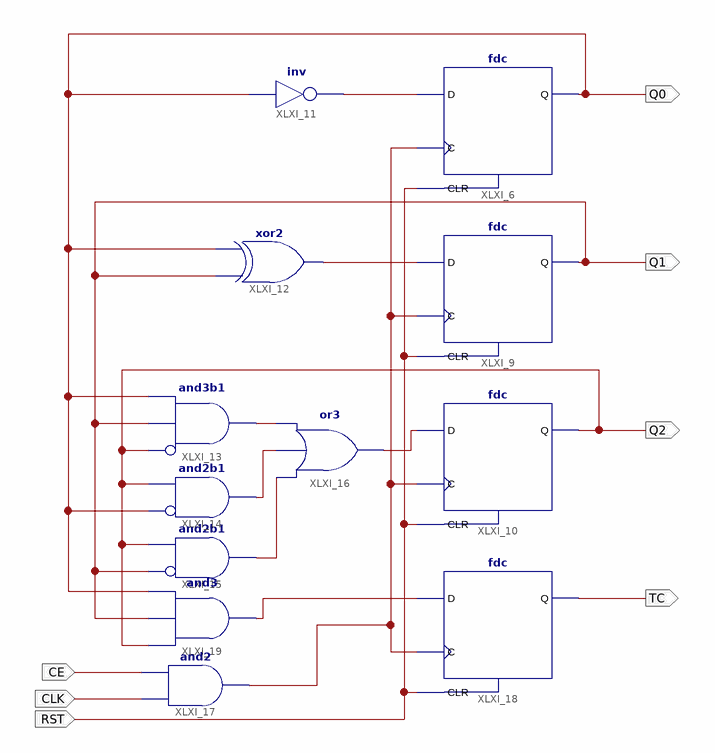
[diagram p0: schematic sheet 1]
// Xilinx ISE schematic licznik3bit.sch (spartan3e) as structural Verilog: 12 symbols, 7 ports
module licznik3bit (
  input  RST,
  input  CLK,
  input  CE,
  output Q0,
  output Q1,
  output Q2,
  output TC
);

  wire XLXN_1, XLXN_4, XLXN_7, XLXN_9, XLXN_10, XLXN_27, XLXN_31, XLXN_40;

  fdc XLXI_6 (.C(XLXN_27), .CLR(RST), .D(XLXN_1), .Q(Q0));
  fdc XLXI_9 (.C(XLXN_27), .CLR(RST), .D(XLXN_4), .Q(Q1));
  fdc XLXI_10 (.C(XLXN_27), .CLR(RST), .D(XLXN_31), .Q(Q2));
  not XLXI_11 (XLXN_1, Q0);
  xor XLXI_12 (XLXN_4, Q1, Q0);
  and XLXI_13 (XLXN_10, ~Q2, Q1, Q0);  // and3b1
  and XLXI_14 (XLXN_9, ~Q0, Q2);  // and2b1
  and XLXI_15 (XLXN_7, ~Q1, Q2);  // and2b1
  or XLXI_16 (XLXN_31, XLXN_7, XLXN_9, XLXN_10);
  and XLXI_17 (XLXN_27, CLK, CE);
  fdc XLXI_18 (.C(XLXN_27), .CLR(RST), .D(XLXN_40), .Q(TC));
  and XLXI_19 (XLXN_40, Q2, Q1, Q0);
endmodule
